# EAGLE design PDB_v0 (EAGLE 9.6.2)
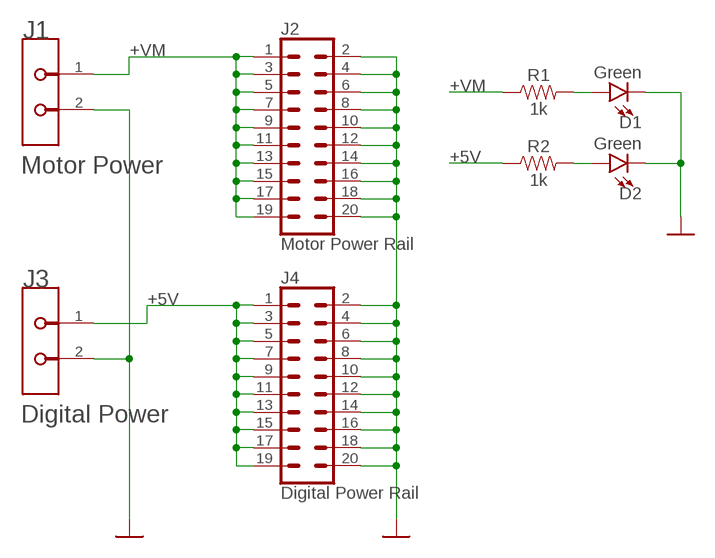
[diagram p0: schematic, sheet 1]

## Parts
D1  Green  LED3MM  [LED_3MM]
D2  Green  LED3MM  [LED_3MM]
J1  Motor Power  TE_282837-2TE_282837-2_0_0  [TE_282837-2_0]
J2  Motor Power Rail  CONN_10X2  [2X10]
J3  Digital Power  TE_282837-2TE_282837-2_0_0  [TE_282837-2_0]
J4  Digital Power Rail  CONN_10X2  [2X10]
R1  1k  RESISTORAXIAL-0.3  [AXIAL-0.3]
R2  1k  RESISTORAXIAL-0.3  [AXIAL-0.3]

## Nets
+5V: J3.1 J4.1 J4.3 J4.5 J4.7 J4.9 J4.11 J4.13 J4.15 J4.17 J4.19 R2.P$1
+VM: J1.1 J2.1 J2.3 J2.5 J2.7 J2.9 J2.11 J2.13 J2.15 J2.17 J2.19 R1.P$1
GND: D1.K(C) D2.K(C) J1.2 J2.2 J2.4 J2.6 J2.8 J2.10 J2.12 J2.14 J2.16 J2.18 J2.20 J3.2 J4.2 J4.4 J4.6 J4.8 J4.10 J4.12 J4.14 J4.16 J4.18 J4.20 ; supply symbol labelled DGND
N$1: D1.A R1.P$2
N$2: D2.A R2.P$2

## Library data of the parts
D1 D2 = SparkFun-LED:LED: LED (Generic) Standard schematic elements and footprints for 5mm, 3mm, 1206, and 0603 sized LEDs. Generic LEDs with no color specified.; PROD_ID: DIO-08794
J1 J3 = RMDrv_FinalNew_Conn_Terminal:TE_282837-2: Conn Terminal Blocks F 2 POS 5.08mm Solder ST Thru-Hole 13.5A/Contact; CENTROID_NOT_SPECIFIED: No; CONN_GENDER: Female; CONN_ORIENTATION: Horizontal; CONTACT_MATERIAL: Tin; CURRENT_RATING: 13.5A; DATASHEET: https://www.te.com/commerce/DocumentDelivery/DDEController?Action=showdoc&DocId=Catalog+Section%7F1308389_EUROSTYLE_TERMINAL_BLOCKS%7F0607%7Fpdf%7FEnglish%7FENG_CS_1308389_EUROSTYLE_TERMINAL_BLOCKS_0607.pdf%7F282837-2; DEVICE_CLASS_L1: Connectors; DEVICE_CLASS_L2: Terminal Blocks | Terminals; DEVICE_CLASS_L3: unset; DIGIKEY_DESCRIPTION: CONN TERM BLOCK 5.08MM 2POS SIDE ENTY; DIGIKEY_PART_NUMBER: A113320-ND; FOOTPRINT_URL: https://www.te.com/commerce/DocumentDelivery/DDEController?Action=showdoc&DocId=Customer+Drawing%7F282837%7FH%7Fpdf%7FEnglish%7FENG_CD_282837_H.pdf%7F282837-2; HEIGHT: 10.3mm; IS_FEMALE: yes; LEAD_FREE: yes; MAX_WIRE_GAUGE: 16; MF: TE; MFG_PACKAGE_IDENT: 282837-2; MFG_PACKAGE_IDENT_DATE: 0; MFG_PACKAGE_IDENT_REV: 0; MIN_WIRE_GAUGE: 30; MOUSER_DESCRIPTION: Fixed Terminal Blocks 5.08MM PCB MOUNT 2P; MOUSER_PART_NUMBER: 571-2828372; MPN: 282837-2; NUMBER_OF_CONTACTS: 2; NUMBER_OF_ROWS: 1; PACKAGE: HDR2; PREFIX: J; ROHS: yes; TEMPERATURE_RANGE_HIGH: +110°C; TEMPERATURE_RANGE_LOW: -40°C; VERIFICATION_VERSION: 0.0.0.1; VOLTAGE_RATING: 300V
J2 J4 = SparkFun-Connectors:CONN_10X2: Multi connection point. Often used as Generic Header-pin footprint for 0.1 inch spaced/style header connections On any of the 0.1 inch spaced packages, you can populate with these: Break Away Headers - Straight <https://www.sparkfun.com/products/116> (PRT-00116) Break Away Male Headers - Right Angle <https://www.sparkfun.com/products/553> (PRT-00553) Female Headers <https://www.sparkfun.com/products/115> (PRT-00115) Break Away Headers - Machine Pin <https://www.sparkfun.com/products/117> (PRT-00117) Break Away Female Headers - Swiss Machine Pin <https://www.sparkfun.com/products/743> (PRT-00743) Special note about the "SPECIAL" package: This was SPECIALLY designed to be used with our Graphic LCD Backpack. Be sure you want to use this! It is not only staggered on each line of header holes, but IT IS ALSO offset of the center point of the top and bottom lines by 5 mil. This causes the headers to lock into place on the "standard" footprint on the LCD screen. The extra squares on the tdocu layer are there simply to reference other pins (if you were to actually populate a longer header than ten long - this is what we do with the backpacks).
R1 R2 = SparkFun-Resistors:RESISTOR: Generic Resistor Package

## Board
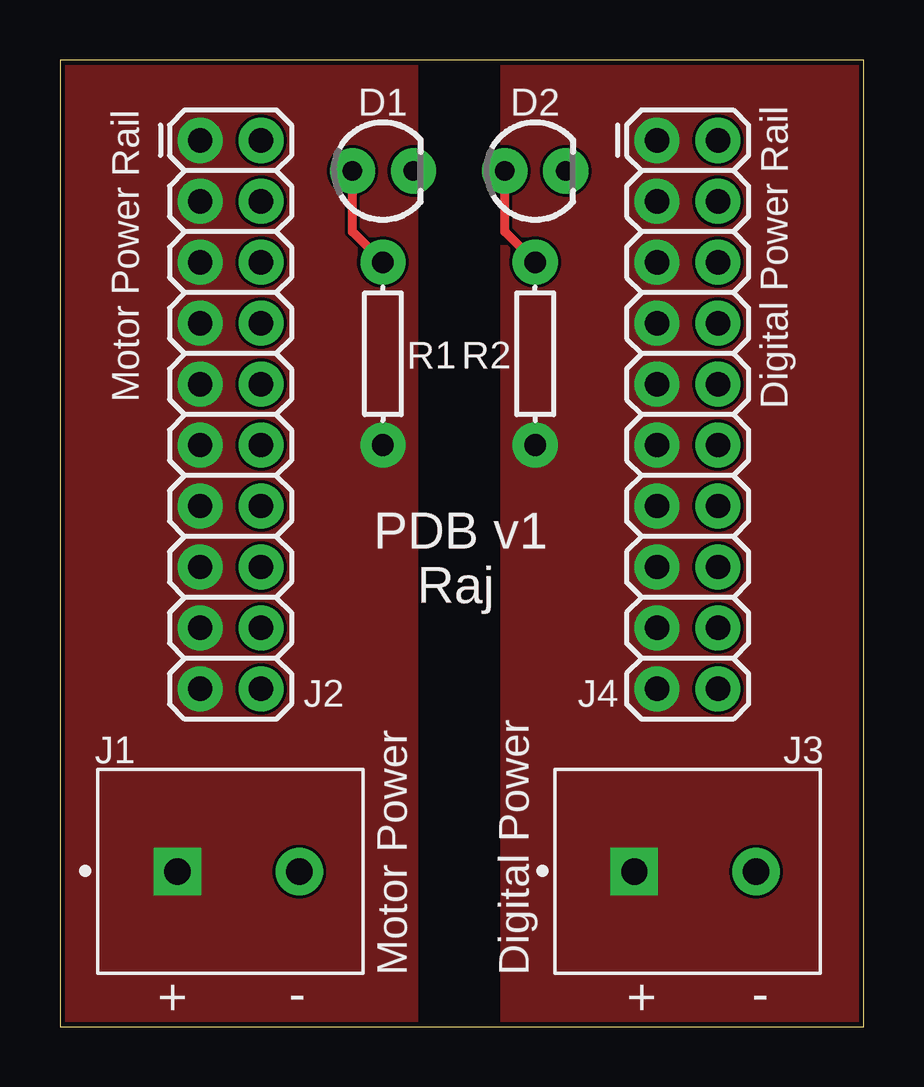
[diagram p1: board, top side]
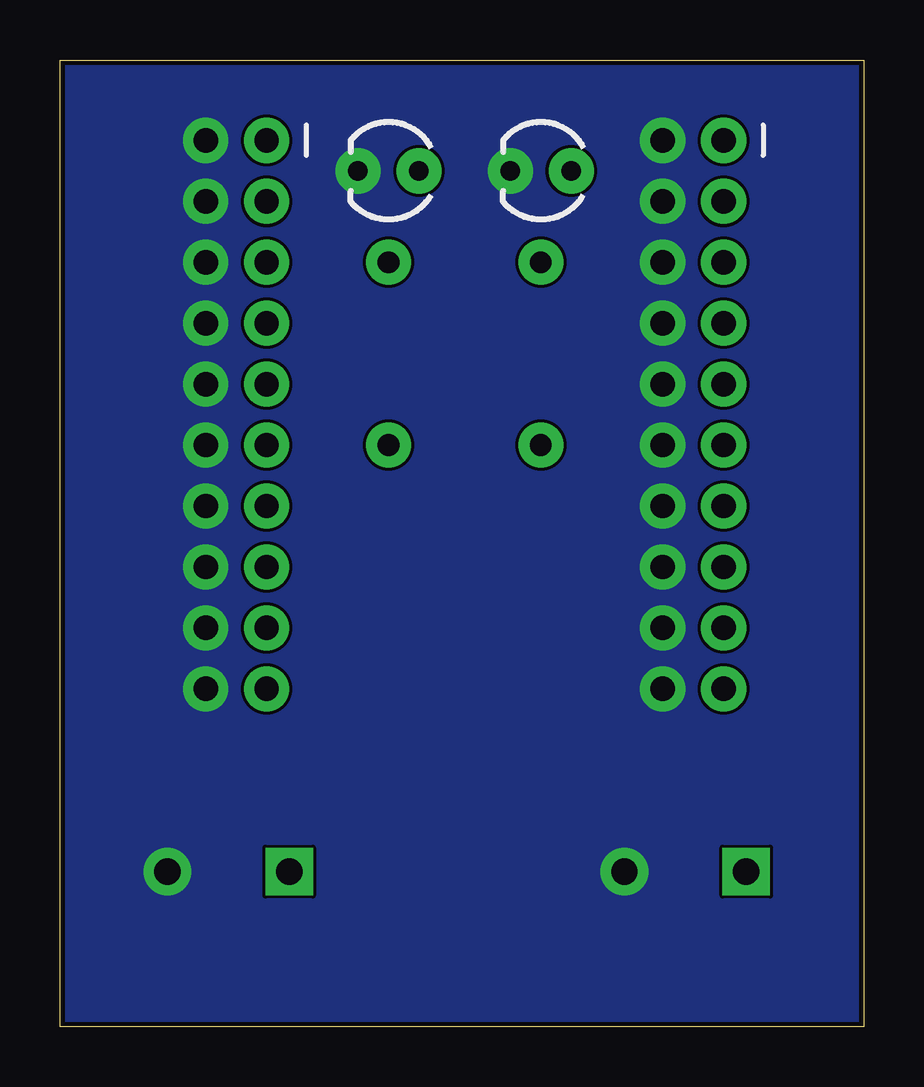
[diagram p2: board, bottom side, seen from below]

Size 33.51 x 40.31 mm. Coordinates in mm from the lower left corner, seen from the top.
Outline: 0,0 33.51,0 33.51,40.31 0,40.31 0,0
Copper layers (1*16): Top 0.035mm / dielectric 1.6mm / Bottom 0.035mm
Design rules "jlcpcb-2layers": minimum track width 5mil, minimum drill 0.3mm, track to track 5mil, track to pad 5mil, pad to pad 5mil, via to via 5mil, smd to smd 5mil, copper to edge 0.2mm, drill to drill 6mil, minimum pad ring 10mil, minimum via ring 3mil, stop-mask expansion 4mil, vias tented up to drill 0mil, thermal gap 10mil

### Footprints (pad centres in the part's own frame; a part is rotated, then mirrored left to right if it is on the bottom)
LED_3MM = drill 0.813 pad 1.88: A -1.27,0; K 1.27,0
TE_282837-2_0 = drill 1.1 pad 1.7 square: 1 -2.215,0 | drill 1.1 pad 1.7: 2 2.865,0
2X10 = drill 1.016 pad 1.88: 1 0,0; 2 0,2.54; 3 2.54,0; 4 2.54,2.54; 5 5.08,0; 6 5.08,2.54; 7 7.62,0; 8 7.62,2.54; 9 10.16,0; 10 10.16,2.54; 11 12.7,0; 12 12.7,2.54; 13 15.24,0; 14 15.24,2.54; 15 17.78,0; 16 17.78,2.54; 17 20.32,0; 18 20.32,2.54; 19 22.86,0; 20 22.86,2.54
AXIAL-0.3 = drill 0.9 pad 1.88: P$1 -3.81,0; P$2 3.81,0

### Placement (x,y rotation side)
D1  13.46,35.69 0 top
D2  19.81,35.69 0 top
J1  7.11,6.48 0 top
J2  5.84,36.96 270 top
J3  26.16,6.48 0 top
J4  24.89,36.96 270 top
R1  13.46,28.07 90 top
R2  19.81,28.07 90 top

### Tracks (layer width: path | path; a pad name or v marks a point on that pad's centre or on a via)
+5V
  pour Top (no thermals): 18.54,40.77 33.78,40.77 33.78,-1.14 19.81,-1.14 18.54,-1.14
+VM
  pour Top (no thermals): -0.51,0.13 -0.51,40.77 14.73,40.77 14.73,-1.14 -0.51,-1.14
GND
  pour Bottom (no thermals): -0.51,40.77 33.78,40.77 33.78,0.13 -0.51,0.13
N$1
  Top 0.381: R1.P$2 12.19,33.15 D1.A
N$2
  Top 0.381: R2.P$2 18.54,33.15 D2.A

### Text on the board
tPlace: PDB v1 / Raj | + | - | + | -